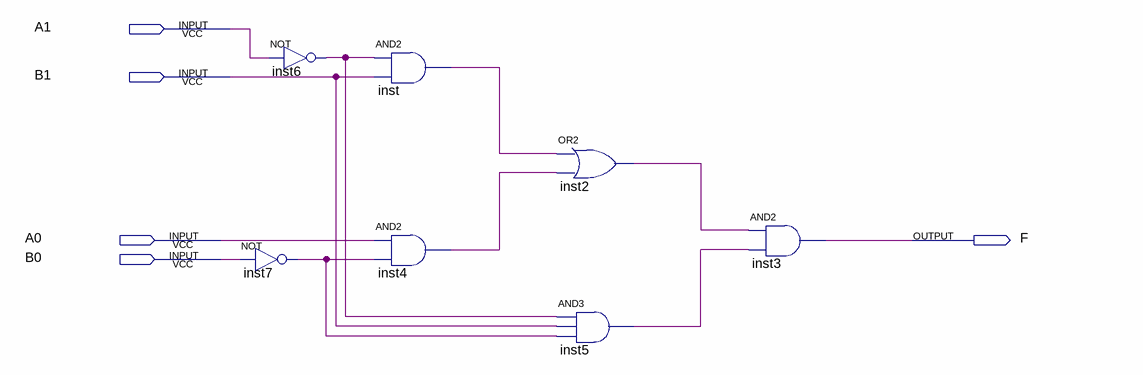
[diagram p0: schematic sheet]
// Quartus schematic p125733.bdf as structural Verilog: 7 symbols, 5 pins
module p125733 (
  input  A1,
  input  B1,
  input  A0,
  input  B0,
  output F
);

  wire inst2_out, inst4_out, inst5_out, inst6_out, inst7_out, inst_out;

  not inst7 (inst7_out, B0);
  not inst6 (inst6_out, A1);
  and inst (inst_out, inst6_out, B1);
  and inst4 (inst4_out, A0, inst7_out);
  or inst2 (inst2_out, inst_out, inst4_out);
  and inst5 (inst5_out, inst6_out, B1, inst7_out);
  and inst3 (F, inst2_out, inst5_out);
endmodule
